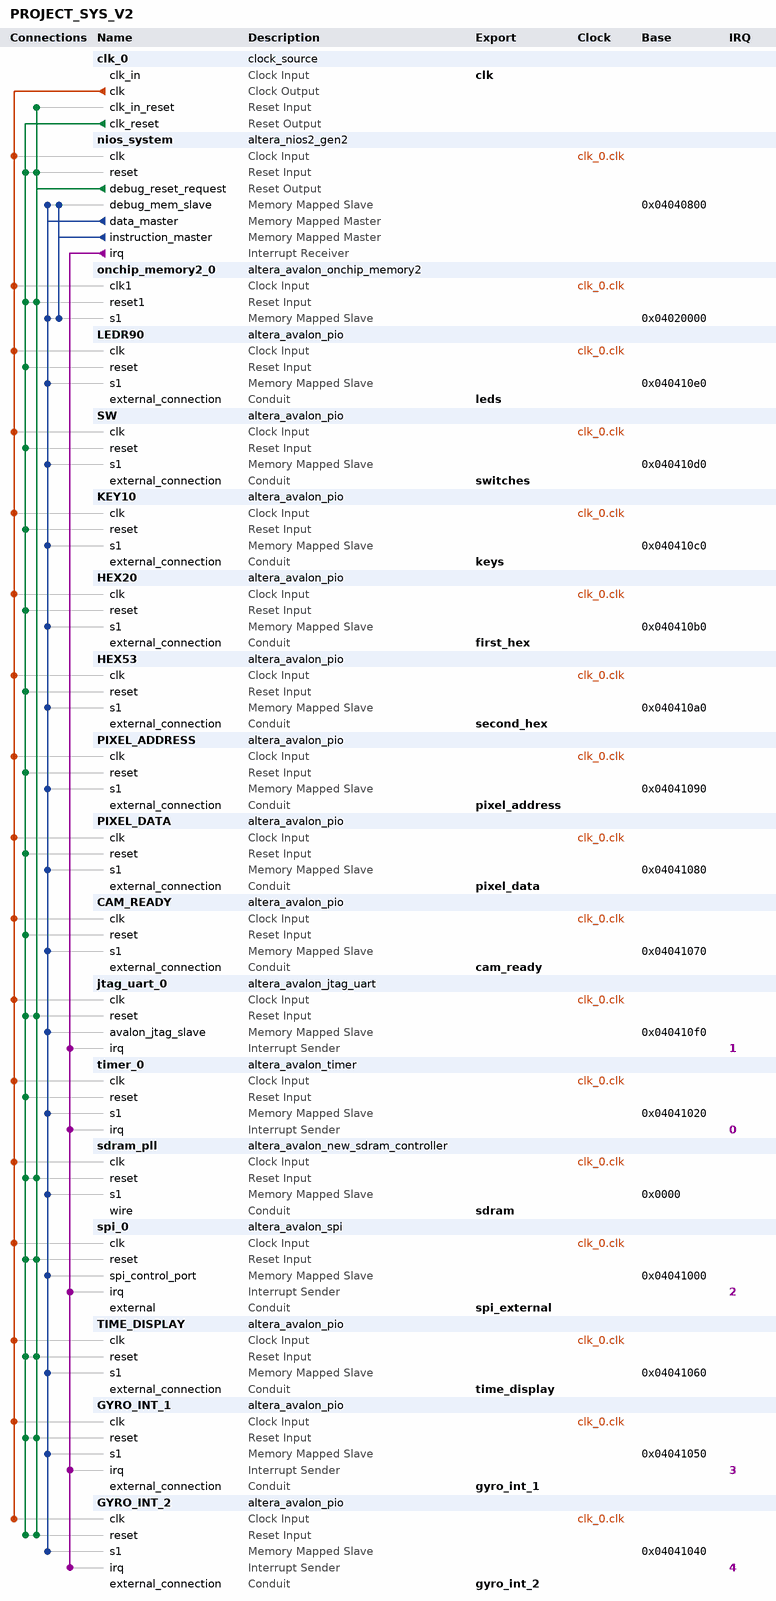
[diagram p0: system contents]
# Platform Designer (Qsys) system PROJECT_SYS_V2, MAX 10 10M50DAF484C7G
# Parameters at their usual value, and those the tool derives, are not listed.
package require -exact qsys 18.1
create_system PROJECT_SYS_V2
set_project_property DEVICE_FAMILY {MAX 10}
set_project_property DEVICE 10M50DAF484C7G

add_instance clk_0 clock_source 18.1
set_instance_parameter_value clk_0 clockFrequency 50000000

add_instance nios_system altera_nios2_gen2 18.1
set_instance_parameter_value nios_system dcache_size 2048
set_instance_parameter_value nios_system exceptionSlave onchip_memory2_0.s1
set_instance_parameter_value nios_system icache_size 4096
set_instance_parameter_value nios_system impl Fast
set_instance_parameter_value nios_system resetSlave onchip_memory2_0.s1

add_instance onchip_memory2_0 altera_avalon_onchip_memory2 18.1
set_instance_parameter_value onchip_memory2_0 dataWidth 32
set_instance_parameter_value onchip_memory2_0 dualPort false
set_instance_parameter_value onchip_memory2_0 initMemContent false
set_instance_parameter_value onchip_memory2_0 initializationFileName onchip_mem.hex
set_instance_parameter_value onchip_memory2_0 memorySize 102400

add_instance LEDR90 altera_avalon_pio 18.1
set_instance_parameter_value LEDR90 direction Output
set_instance_parameter_value LEDR90 width 10

add_instance SW altera_avalon_pio 18.1
set_instance_parameter_value SW direction Input
set_instance_parameter_value SW width 10

add_instance KEY10 altera_avalon_pio 18.1
set_instance_parameter_value KEY10 direction Input
set_instance_parameter_value KEY10 width 2

add_instance HEX20 altera_avalon_pio 18.1
set_instance_parameter_value HEX20 direction Output
set_instance_parameter_value HEX20 width 24

add_instance HEX53 altera_avalon_pio 18.1
set_instance_parameter_value HEX53 direction Output
set_instance_parameter_value HEX53 width 24

add_instance PIXEL_ADDRESS altera_avalon_pio 18.1
set_instance_parameter_value PIXEL_ADDRESS direction Output
set_instance_parameter_value PIXEL_ADDRESS width 17

add_instance PIXEL_DATA altera_avalon_pio 18.1
set_instance_parameter_value PIXEL_DATA direction Output
set_instance_parameter_value PIXEL_DATA width 4

add_instance CAM_READY altera_avalon_pio 18.1
set_instance_parameter_value CAM_READY direction Input
set_instance_parameter_value CAM_READY width 1

add_instance jtag_uart_0 altera_avalon_jtag_uart 18.1
set_instance_parameter_value jtag_uart_0 readBufferDepth 256
set_instance_parameter_value jtag_uart_0 simInteractiveOptions NO_INTERACTIVE_WINDOWS
set_instance_parameter_value jtag_uart_0 writeBufferDepth 256

add_instance timer_0 altera_avalon_timer 18.1
set_instance_parameter_value timer_0 period 1
set_instance_parameter_value timer_0 periodUnits MSEC

add_instance sdram_pll altera_avalon_new_sdram_controller 18.1
set_instance_parameter_value sdram_pll TAC 5.5
set_instance_parameter_value sdram_pll TRCD 20.0
set_instance_parameter_value sdram_pll TRP 20.0
set_instance_parameter_value sdram_pll casLatency 3
set_instance_parameter_value sdram_pll columnWidth 10
set_instance_parameter_value sdram_pll dataWidth 16
set_instance_parameter_value sdram_pll generateSimulationModel false
set_instance_parameter_value sdram_pll model single_Micron_MT48LC4M32B2_7_chip
set_instance_parameter_value sdram_pll numberOfBanks 4
set_instance_parameter_value sdram_pll numberOfChipSelects 1
set_instance_parameter_value sdram_pll powerUpDelay 100.0
set_instance_parameter_value sdram_pll refreshPeriod 15.625
set_instance_parameter_value sdram_pll rowWidth 13

add_instance spi_0 altera_avalon_spi 18.1
set_instance_parameter_value spi_0 clockPhase 1
set_instance_parameter_value spi_0 clockPolarity 1
set_instance_parameter_value spi_0 dataWidth 8
set_instance_parameter_value spi_0 masterSPI true
set_instance_parameter_value spi_0 numberOfSlaves 2
set_instance_parameter_value spi_0 targetClockRate 5000000

add_instance TIME_DISPLAY altera_avalon_pio 18.1
set_instance_parameter_value TIME_DISPLAY direction Input
set_instance_parameter_value TIME_DISPLAY width 32

add_instance GYRO_INT_1 altera_avalon_pio 18.1
set_instance_parameter_value GYRO_INT_1 captureEdge true
set_instance_parameter_value GYRO_INT_1 direction Input
set_instance_parameter_value GYRO_INT_1 generateIRQ true
set_instance_parameter_value GYRO_INT_1 irqType EDGE
set_instance_parameter_value GYRO_INT_1 width 1

add_instance GYRO_INT_2 altera_avalon_pio 18.1
set_instance_parameter_value GYRO_INT_2 captureEdge true
set_instance_parameter_value GYRO_INT_2 direction Input
set_instance_parameter_value GYRO_INT_2 generateIRQ true
set_instance_parameter_value GYRO_INT_2 irqType EDGE
set_instance_parameter_value GYRO_INT_2 width 1

# connections
add_connection clk_0.clk CAM_READY.clk clock
add_connection clk_0.clk GYRO_INT_1.clk clock
add_connection clk_0.clk GYRO_INT_2.clk clock
add_connection clk_0.clk HEX20.clk clock
add_connection clk_0.clk HEX53.clk clock
add_connection clk_0.clk jtag_uart_0.clk clock
add_connection clk_0.clk KEY10.clk clock
add_connection clk_0.clk LEDR90.clk clock
add_connection clk_0.clk nios_system.clk clock
add_connection clk_0.clk onchip_memory2_0.clk1 clock
add_connection clk_0.clk PIXEL_ADDRESS.clk clock
add_connection clk_0.clk PIXEL_DATA.clk clock
add_connection clk_0.clk sdram_pll.clk clock
add_connection clk_0.clk spi_0.clk clock
add_connection clk_0.clk SW.clk clock
add_connection clk_0.clk TIME_DISPLAY.clk clock
add_connection clk_0.clk timer_0.clk clock
add_connection clk_0.clk_reset CAM_READY.reset reset
add_connection clk_0.clk_reset GYRO_INT_1.reset reset
add_connection clk_0.clk_reset GYRO_INT_2.reset reset
add_connection clk_0.clk_reset HEX20.reset reset
add_connection clk_0.clk_reset HEX53.reset reset
add_connection clk_0.clk_reset jtag_uart_0.reset reset
add_connection clk_0.clk_reset KEY10.reset reset
add_connection clk_0.clk_reset LEDR90.reset reset
add_connection clk_0.clk_reset nios_system.reset reset
add_connection clk_0.clk_reset onchip_memory2_0.reset1 reset
add_connection clk_0.clk_reset PIXEL_ADDRESS.reset reset
add_connection clk_0.clk_reset PIXEL_DATA.reset reset
add_connection clk_0.clk_reset sdram_pll.reset reset
add_connection clk_0.clk_reset spi_0.reset reset
add_connection clk_0.clk_reset SW.reset reset
add_connection clk_0.clk_reset TIME_DISPLAY.reset reset
add_connection clk_0.clk_reset timer_0.reset reset
add_connection nios_system.debug_reset_request clk_0.clk_in_reset reset
add_connection nios_system.debug_reset_request GYRO_INT_1.reset reset
add_connection nios_system.debug_reset_request GYRO_INT_2.reset reset
add_connection nios_system.debug_reset_request jtag_uart_0.reset reset
add_connection nios_system.debug_reset_request nios_system.reset reset
add_connection nios_system.debug_reset_request onchip_memory2_0.reset1 reset
add_connection nios_system.debug_reset_request sdram_pll.reset reset
add_connection nios_system.debug_reset_request spi_0.reset reset
add_connection nios_system.debug_reset_request TIME_DISPLAY.reset reset
add_connection nios_system.data_master CAM_READY.s1 avalon
set_connection_parameter_value nios_system.data_master/CAM_READY.s1 baseAddress 0x04041070
add_connection nios_system.data_master GYRO_INT_1.s1 avalon
set_connection_parameter_value nios_system.data_master/GYRO_INT_1.s1 baseAddress 0x04041050
add_connection nios_system.data_master GYRO_INT_2.s1 avalon
set_connection_parameter_value nios_system.data_master/GYRO_INT_2.s1 baseAddress 0x04041040
add_connection nios_system.data_master HEX20.s1 avalon
set_connection_parameter_value nios_system.data_master/HEX20.s1 baseAddress 0x040410b0
add_connection nios_system.data_master HEX53.s1 avalon
set_connection_parameter_value nios_system.data_master/HEX53.s1 baseAddress 0x040410a0
add_connection nios_system.data_master jtag_uart_0.avalon_jtag_slave avalon
set_connection_parameter_value nios_system.data_master/jtag_uart_0.avalon_jtag_slave baseAddress 0x040410f0
add_connection nios_system.data_master KEY10.s1 avalon
set_connection_parameter_value nios_system.data_master/KEY10.s1 baseAddress 0x040410c0
add_connection nios_system.data_master LEDR90.s1 avalon
set_connection_parameter_value nios_system.data_master/LEDR90.s1 baseAddress 0x040410e0
add_connection nios_system.data_master nios_system.debug_mem_slave avalon
set_connection_parameter_value nios_system.data_master/nios_system.debug_mem_slave baseAddress 0x04040800
add_connection nios_system.data_master onchip_memory2_0.s1 avalon
set_connection_parameter_value nios_system.data_master/onchip_memory2_0.s1 baseAddress 0x04020000
add_connection nios_system.data_master PIXEL_ADDRESS.s1 avalon
set_connection_parameter_value nios_system.data_master/PIXEL_ADDRESS.s1 baseAddress 0x04041090
add_connection nios_system.data_master PIXEL_DATA.s1 avalon
set_connection_parameter_value nios_system.data_master/PIXEL_DATA.s1 baseAddress 0x04041080
add_connection nios_system.data_master sdram_pll.s1 avalon
set_connection_parameter_value nios_system.data_master/sdram_pll.s1 baseAddress 0x0000
add_connection nios_system.data_master spi_0.spi_control_port avalon
set_connection_parameter_value nios_system.data_master/spi_0.spi_control_port baseAddress 0x04041000
add_connection nios_system.data_master SW.s1 avalon
set_connection_parameter_value nios_system.data_master/SW.s1 baseAddress 0x040410d0
add_connection nios_system.data_master TIME_DISPLAY.s1 avalon
set_connection_parameter_value nios_system.data_master/TIME_DISPLAY.s1 baseAddress 0x04041060
add_connection nios_system.data_master timer_0.s1 avalon
set_connection_parameter_value nios_system.data_master/timer_0.s1 baseAddress 0x04041020
add_connection nios_system.instruction_master nios_system.debug_mem_slave avalon
set_connection_parameter_value nios_system.instruction_master/nios_system.debug_mem_slave baseAddress 0x04040800
add_connection nios_system.instruction_master onchip_memory2_0.s1 avalon
set_connection_parameter_value nios_system.instruction_master/onchip_memory2_0.s1 baseAddress 0x04020000
add_connection nios_system.irq GYRO_INT_1.irq interrupt
set_connection_parameter_value nios_system.irq/GYRO_INT_1.irq irqNumber 3
add_connection nios_system.irq GYRO_INT_2.irq interrupt
set_connection_parameter_value nios_system.irq/GYRO_INT_2.irq irqNumber 4
add_connection nios_system.irq jtag_uart_0.irq interrupt
set_connection_parameter_value nios_system.irq/jtag_uart_0.irq irqNumber 1
add_connection nios_system.irq spi_0.irq interrupt
set_connection_parameter_value nios_system.irq/spi_0.irq irqNumber 2
add_connection nios_system.irq timer_0.irq interrupt
set_connection_parameter_value nios_system.irq/timer_0.irq irqNumber 0

# exported interfaces
add_interface cam_ready conduit end
set_interface_property cam_ready EXPORT_OF CAM_READY.external_connection
add_interface clk clock sink
set_interface_property clk EXPORT_OF clk_0.clk_in
add_interface first_hex conduit end
set_interface_property first_hex EXPORT_OF HEX20.external_connection
add_interface gyro_int_1 conduit end
set_interface_property gyro_int_1 EXPORT_OF GYRO_INT_1.external_connection
add_interface gyro_int_2 conduit end
set_interface_property gyro_int_2 EXPORT_OF GYRO_INT_2.external_connection
add_interface keys conduit end
set_interface_property keys EXPORT_OF KEY10.external_connection
add_interface leds conduit end
set_interface_property leds EXPORT_OF LEDR90.external_connection
add_interface pixel_address conduit end
set_interface_property pixel_address EXPORT_OF PIXEL_ADDRESS.external_connection
add_interface pixel_data conduit end
set_interface_property pixel_data EXPORT_OF PIXEL_DATA.external_connection
add_interface sdram conduit end
set_interface_property sdram EXPORT_OF sdram_pll.wire
add_interface second_hex conduit end
set_interface_property second_hex EXPORT_OF HEX53.external_connection
add_interface spi_external conduit end
set_interface_property spi_external EXPORT_OF spi_0.external
add_interface switches conduit end
set_interface_property switches EXPORT_OF SW.external_connection
add_interface time_display conduit end
set_interface_property time_display EXPORT_OF TIME_DISPLAY.external_connection

set_interconnect_requirement {$system} qsys_mm.clockCrossingAdapter HANDSHAKE
set_interconnect_requirement {$system} qsys_mm.enableEccProtection FALSE
set_interconnect_requirement {$system} qsys_mm.insertDefaultSlave FALSE
set_interconnect_requirement {$system} qsys_mm.maxAdditionalLatency 1

save_system PROJECT_SYS_V2.qsys
